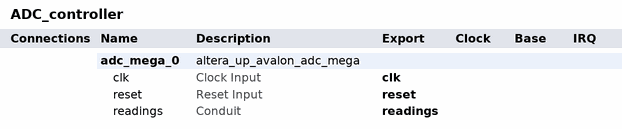
[diagram p0: system contents]
# Platform Designer (Qsys) system ADC_controller, MAX 10 10M50DAF484C6GES
# Parameters at their usual value, and those the tool derives, are not listed.
package require -exact qsys 17.1
create_system ADC_controller
set_project_property DEVICE_FAMILY {MAX 10}
set_project_property DEVICE 10M50DAF484C6GES

add_instance adc_mega_0 altera_up_avalon_adc_mega 17.1
set_instance_property adc_mega_0 AUTO_EXPORT true
set_instance_parameter_value adc_mega_0 board DE10-Lite
set_instance_parameter_value adc_mega_0 numch_ 6
set_instance_parameter_value adc_mega_0 sclk_freq 10.0

# exported interfaces
add_interface clk clock sink
set_interface_property clk EXPORT_OF adc_mega_0.clk
add_interface readings conduit end
set_interface_property readings EXPORT_OF adc_mega_0.readings
add_interface reset reset sink
set_interface_property reset EXPORT_OF adc_mega_0.reset

set_interconnect_requirement {$system} qsys_mm.clockCrossingAdapter HANDSHAKE
set_interconnect_requirement {$system} qsys_mm.enableEccProtection FALSE
set_interconnect_requirement {$system} qsys_mm.insertDefaultSlave FALSE
set_interconnect_requirement {$system} qsys_mm.maxAdditionalLatency 1

save_system ADC_controller.qsys
